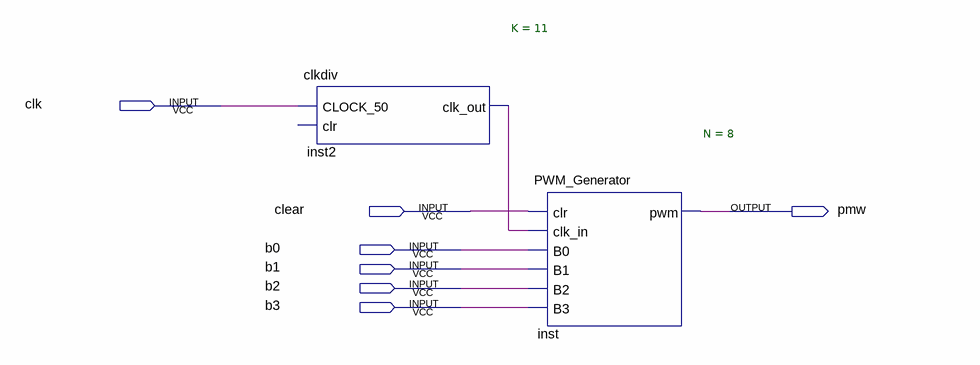
[diagram p0: schematic sheet]
// Quartus schematic motor.bdf as structural Verilog: 2 symbols, 7 pins
module motor (
  input  clk,
  input  clear,
  input  b0,
  input  b1,
  input  b2,
  input  b3,
  output pmw
);

  wire inst2_clk_out;

  clkdiv #(.K(11)) inst2 (.CLOCK_50(clk), .clk_out(inst2_clk_out));  // open: clr
  PWM_Generator #(.N(8)) inst (.clr(clear), .clk_in(inst2_clk_out), .B0(b0), .B1(b1), .B2(b2), .B3(b3), .pwm(pmw));
endmodule
